# Altium schematic sheet invert.SchDoc
size A4; DocumentNumber: 5; SheetNumber: 5; SheetTotal: 9
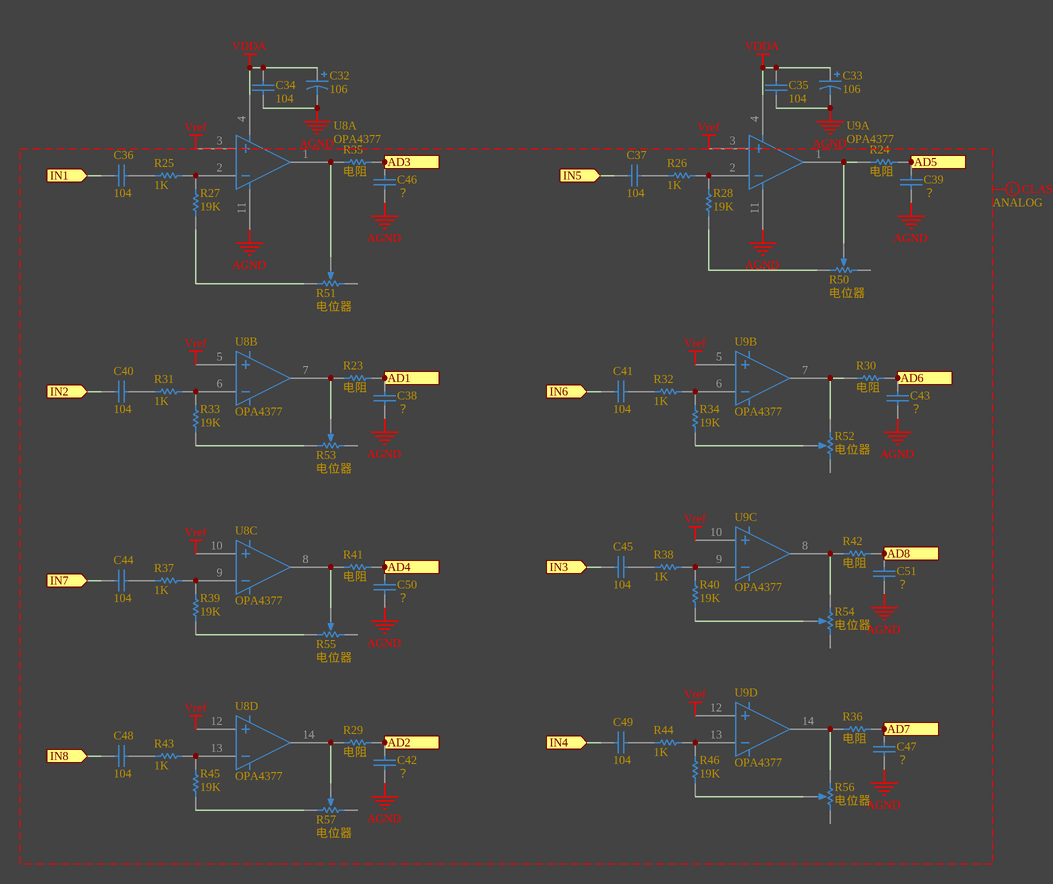
[diagram p0: invert.SchDoc]

## Parts
C32  106  [3216-ce]
C33  106  [3216-ce]
C34  104  [C0402]
C35  104  [C0402]
C36  104  [C0402]
C37  104  [C0402]
C38  ？  [C0402]
C39  ？  [C0402]
C40  104  [C0402]
C41  104  [C0402]
C42  ？  [C0402]
C43  ？  [C0402]
C44  104  [C0402]
C45  104  [C0402]
C46  ？  [C0402]
C47  ？  [C0402]
C48  104  [C0402]
C49  104  [C0402]
C50  ？  [C0402]
C51  ？  [C0402]
R23  电阻  [R0402]
R24  电阻  [R0402]
R25  1K  [R0402]
R26  1K  [R0402]
R27  19K  [R0402]
R28  19K  [R0402]
R29  电阻  [R0402]
R30  电阻  [R0402]
R31  1K  [R0402]
R32  1K  [R0402]
R33  19K  [R0402]
R34  19K  [R0402]
R35  电阻  [R0402]
R36  电阻  [R0402]
R37  1K  [R0402]
R38  1K  [R0402]
R39  19K  [R0402]
R40  19K  [R0402]
R41  电阻  [R0402]
R42  电阻  [R0402]
R43  1K  [R0402]
R44  1K  [R0402]
R45  19K  [R0402]
R46  19K  [R0402]
R50  电位器  [3296W]
R51  电位器  [3296W]
R52  电位器  [3296W]
R53  电位器  [3296W]
R54  电位器  [3296W]
R55  电位器  [3296W]
R56  电位器  [3296W]
R57  电位器  [3296W]
U8  OPA4377  [TSSOP-14]  (parts A,B,C,D of 4)
U9  OPA4377  [TSSOP-14]  (parts A,B,C,D of 4)

## Ports
AD1 (out), AD2 (out), AD3 (out), AD4 (out), AD5 (out), AD6 (out), AD7 (out), AD8 (out), IN1 (in), IN2 (in), IN3 (in), IN4 (in), IN5 (in), IN6 (in), IN7 (in), IN8 (in)

## Nets
AGND: C32.2 C33.2 C34.1 C35.1 C38.1 C39.1 C42.1 C43.1 C46.1 C47.1 C50.1 C51.1 U8.11 U9.11
VDDA: C32.1 C33.1 C34.2 C35.2 U8.4 U9.4
Vref: U8.3 U8.5 U8.10 U8.12 U9.3 U9.5 U9.10 U9.12
AD1: C38.2 R23.1 ; port AD1
AD2: C42.2 R29.1 ; port AD2
AD3: C46.2 R35.1 ; port AD3
AD4: C50.2 R41.1 ; port AD4
AD5: C39.2 R24.1 ; port AD5
AD6: C43.2 R30.1 ; port AD6
AD7: C47.2 R36.1 ; port AD7
AD8: C51.2 R42.1 ; port AD8
IN1: C36.1 ; port IN1
IN2: C40.1 ; port IN2
IN3: C45.1 ; port IN3
IN4: C49.1 ; port IN4
IN5: C37.1 ; port IN5
IN6: C41.1 ; port IN6
IN7: C44.1 ; port IN7
IN8: C48.1 ; port IN8
NetC36_2: C36.2 R25.2
NetC37_2: C37.2 R26.2
NetC40_2: C40.2 R31.2
NetC41_2: C41.2 R32.2
NetC44_2: C44.2 R37.2
NetC45_2: C45.2 R38.2
NetC48_2: C48.2 R43.2
NetC49_2: C49.2 R44.2
NetR23_2: R23.2 R53.2(TAP) U8.7
NetR24_2: R24.2 R50.2(TAP) U9.1
NetR25_1: R25.1 R27.1 U8.2
NetR26_1: R26.1 R28.1 U9.2
NetR27_2: R27.2 R51.3(BOT)
NetR28_2: R28.2 R50.3(BOT)
NetR29_2: R29.2 R57.2(TAP) U8.14
NetR30_2: R30.2 R52.1(TOP) U9.7
NetR31_1: R31.1 R33.1 U8.6
NetR32_1: R32.1 R34.1 U9.6
NetR33_2: R33.2 R53.3(BOT)
NetR34_2: R34.2 R52.2(TAP)
NetR35_2: R35.2 R51.2(TAP) U8.1
NetR36_2: R36.2 R56.1(TOP) U9.14
NetR37_1: R37.1 R39.1 U8.9
NetR38_1: R38.1 R40.1 U9.9
NetR39_2: R39.2 R55.3(BOT)
NetR40_2: R40.2 R54.2(TAP)
NetR41_2: R41.2 R55.2(TAP) U8.8
NetR42_2: R42.2 R54.1(TOP) U9.8
NetR43_1: R43.1 R45.1 U8.13
NetR44_1: R44.1 R46.1 U9.13
NetR45_2: R45.2 R57.3(BOT)
NetR46_2: R46.2 R56.2(TAP)

Not connected (* = marked no-connect by the designer): R50 1(TOP); R51 1(TOP); R52 3(BOT); R53 1(TOP); R54 3(BOT); R55 1(TOP); R56 3(BOT); R57 1(TOP)

## Layout directives
net class ANALOG: AGND, Vref

## Library data of the parts
C32 C33 = 电解电容: Polarized Capacitor (Axial); Value: 100pF; Published: 8-Jun-2000; LatestRevisionDate: 17-Jul-2002; LatestRevisionNote: Re-released for DXP Platform.; PackageReference: POLAR0.8; Publisher: Altium Limited; PackageDescription: Polarized Capacitor; 2 Leads
C34-C51 = 电容: Capacitor; Value: 22pF; Published: 8-Jun-2000; LatestRevisionDate: 17-Jul-2002; LatestRevisionNote: Re-released for DXP Platform.; PackageReference: RAD-0.3; Publisher: Altium Limited; PackageDescription: Radial Cap, Thru-Hole; 2 Leads; 0.3 in Pin Spacing
R23-R46 = 电阻: Resistor; Value: 150R; Published: 8-Jun-2000; LatestRevisionDate: 17-Jul-2002; LatestRevisionNote: Re-released for DXP Platform.; PackageReference: AXIAL-0.3; Publisher: Altium Limited; PackageDescription: Axial Device, Thru-Hole; 2 Leads; 0.3 in Pin Spacing
U8 U9 = 4运放